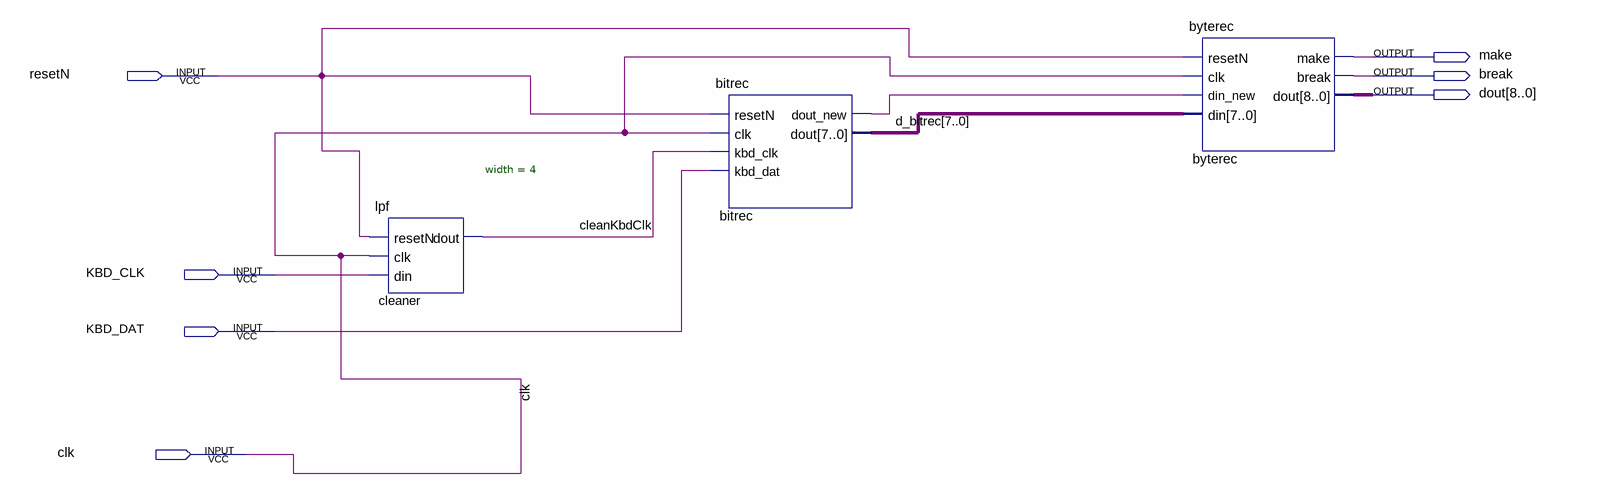
[diagram p0: schematic sheet]
// Quartus schematic KBD.bdf as structural Verilog: 3 symbols, 7 pins
module KBD (
  input  resetN,
  input  KBD_CLK,
  input  KBD_DAT,
  input  clk,
  output make,
  output \break ,
  output [8:0] dout
);

  wire bitrec_dout_new, cleanKbdClk;
  wire [7:0] d_bitrec;

  lpf #(.width(4)) cleaner (.resetN(resetN), .clk(clk), .din(KBD_CLK), .dout(cleanKbdClk));
  bitrec bitrec (
    .resetN(resetN), .clk(clk), .kbd_clk(cleanKbdClk), .kbd_dat(KBD_DAT), .dout_new(bitrec_dout_new),
    .dout(d_bitrec));
  byterec byterec (
    .resetN(resetN), .clk(clk), .din_new(bitrec_dout_new), .din(d_bitrec), .make(make), .\break (\break ),
    .dout(dout));
endmodule
